# EAGLE design sd_adapter (EAGLE 7.6.0)
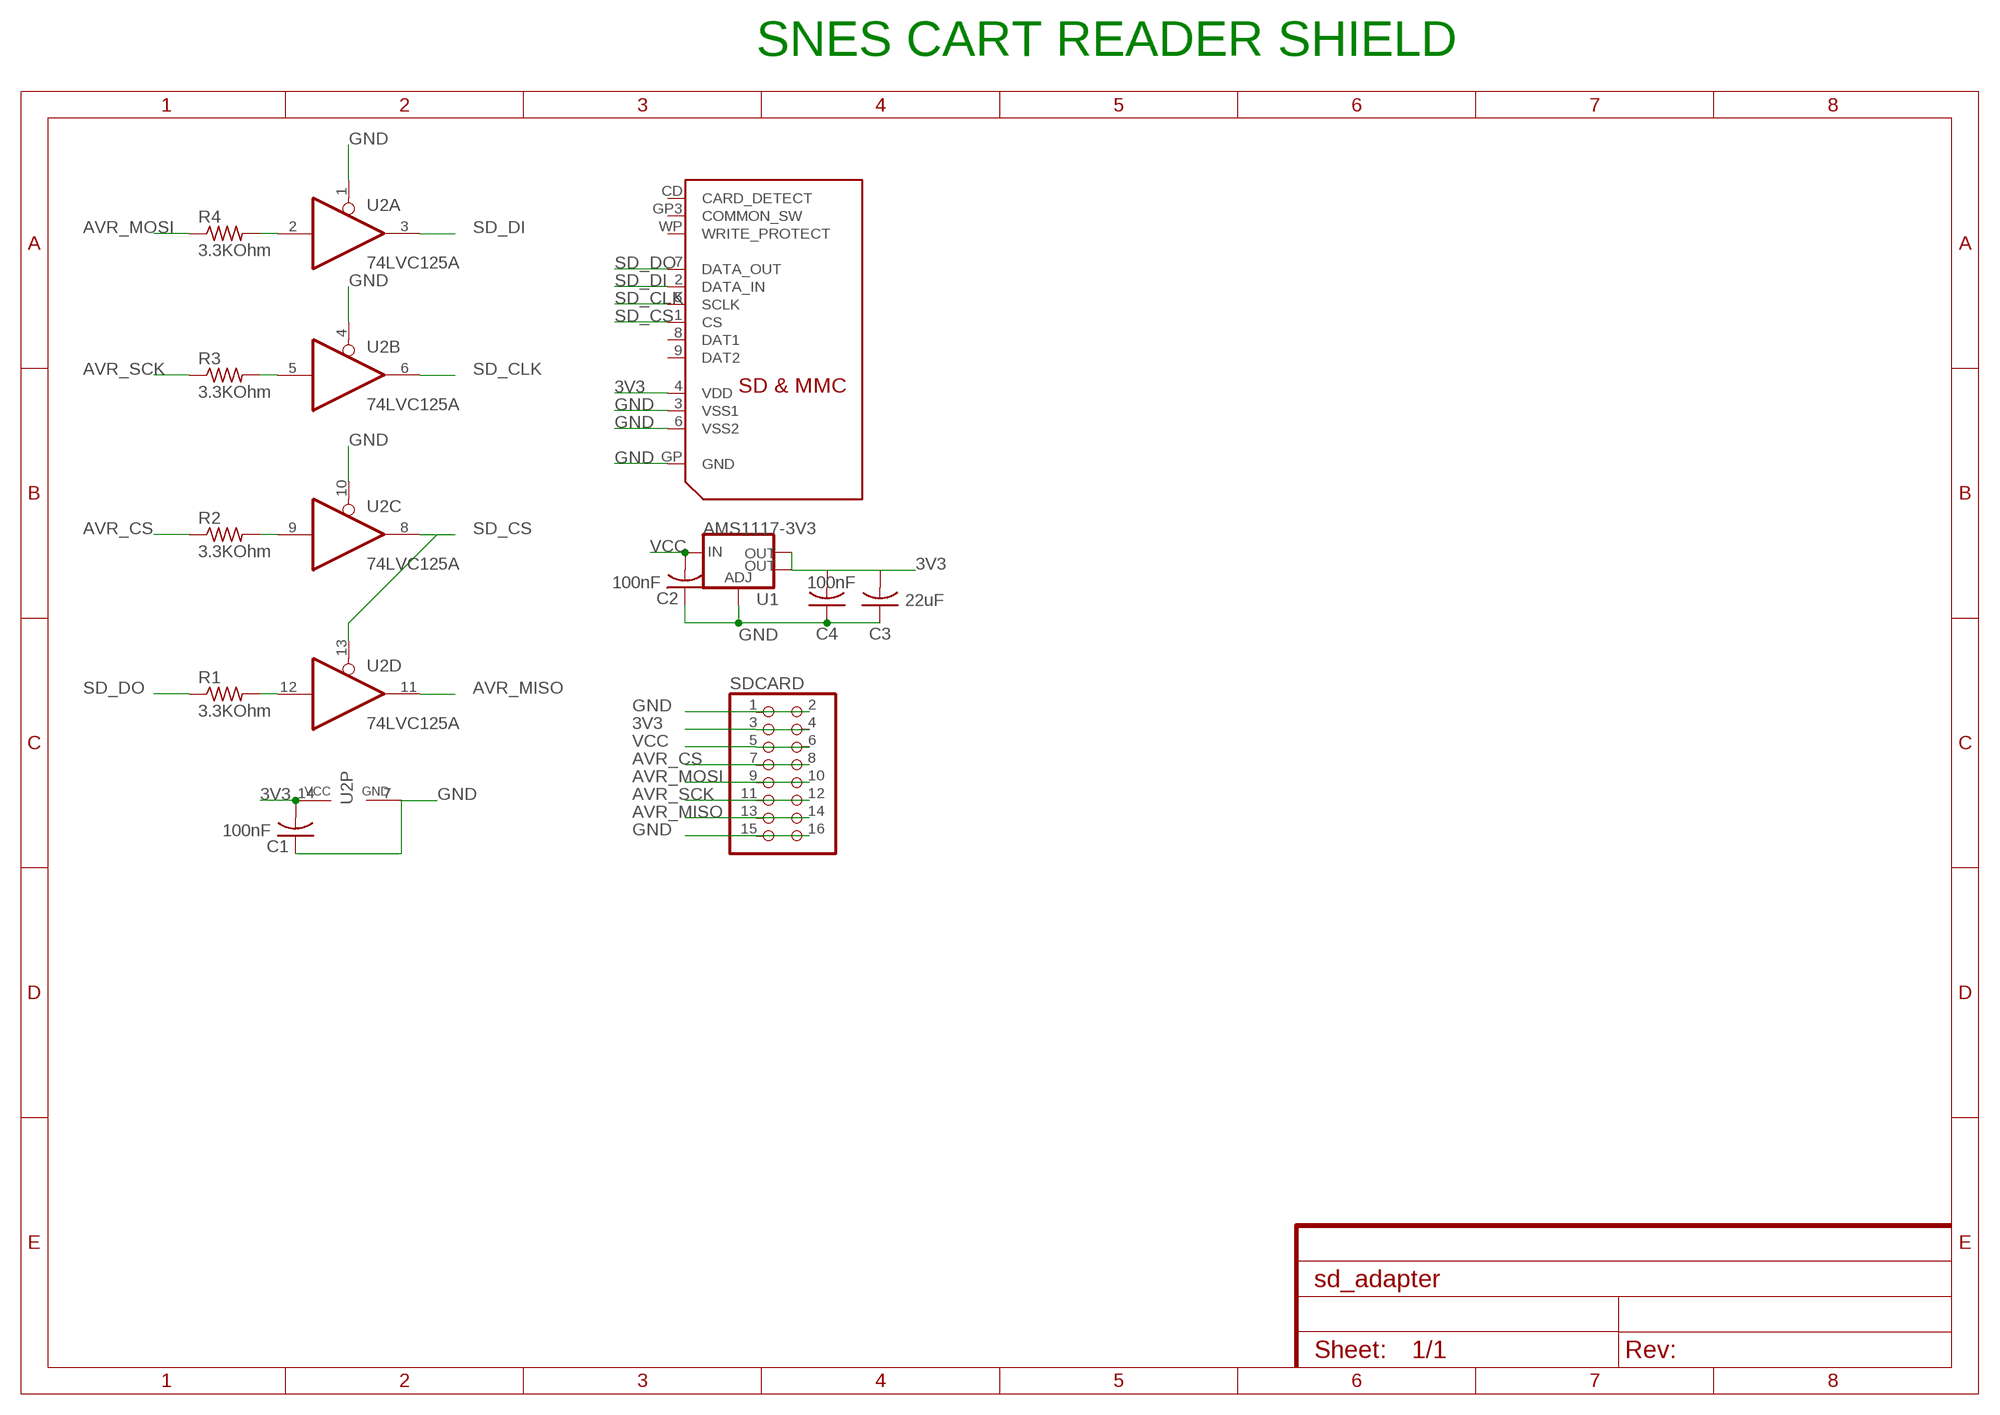
[diagram p0: schematic, sheet 1]

## Parts
C1  100nF  C-USC0805  [C0805]
C2  100nF  C-USC0805  [C0805]
C3  22uF  C-USC0805  [C0805]
C4  100nF  C-USC0805  [C0805]
R1  3.3KOhm  R-US_R0805  [R0805]
R2  3.3KOhm  R-US_R0805  [R0805]
R3  3.3KOhm  R-US_R0805  [R0805]
R4  3.3KOhm  R-US_R0805  [R0805]
SDCARD  PINHD-2X8_2.54  [2X08]
U1  AMS1117-3V3  SMD-AMS1117SOT223  [SOT223]
U2  74LVC125A  74ABT125PW  [TSSOP14]
U$1  SDMMC06132  [06132]

## Nets
3V3 [power usb]: C1.2 C3.2 C4.2 SDCARD.3 SDCARD.4 U1.2(OUT) U1.4(OUT) U2.14(P:VCC) U$1.4(VDD)
AVR_CS: R2.1 SDCARD.7 SDCARD.8
AVR_MISO: SDCARD.13 SDCARD.14 U2.11(D:O)
AVR_MOSI: R4.1 SDCARD.9 SDCARD.10
AVR_SCK: R3.1 SDCARD.11 SDCARD.12
GND [gnd]: C1.1 C2.1 C3.1 C4.1 SDCARD.1 SDCARD.2 SDCARD.15 SDCARD.16 U1.1(ADJ) U2.1(A:OE) U2.4(B:OE) U2.7(P:GND) U2.10(C:OE) U$1.3(VSS1) U$1.6(VSS2) U$1.GP(GND)
N$7: R1.2 U2.12(D:I)
N$10: R2.2 U2.9(C:I)
N$12: R3.2 U2.5(B:I)
N$14: R4.2 U2.2(A:I)
SD_CLK: U2.6(B:O) U$1.5(SCLK)
SD_CS: U2.8(C:O) U2.13(D:OE) U$1.1(CS)
SD_DI: U2.3(A:O) U$1.2(DATA_IN)
SD_DO: R1.1 U$1.7(DATA_OUT)
VCC: C2.2 SDCARD.5 SDCARD.6 U1.3(IN)
Unconnected: U$1.8(DAT1) U$1.9(DAT2) U$1.CD(CARD_DETECT) U$1.GP3(COMMON_SW) U$1.WP(WRITE_PROTECT)

## Notes on the sheet
- SNES CART READER SHIELD

## Library data of the parts
C1-C4 = adafruit:C-US: CAPACITOR, American symbol
R1-R4 = adafruit:R-US_: RESISTOR, American symbol
SDCARD = cartreadershield:PINHD-2X8: PIN HEADER
U1 = !sanni:SMD-AMS1117: Voltage Regulator LM1117 Standard adjustable voltage regulator but in SMD form. Spark Fun Electronics SKU : COM-00595; PROD_ID: VREG-08170
U2 = 74xx-eu:74*125: Quad bus BUFFER, 3-state
U$1 = adafruit:SDMMC: SD MMC Card holder 4UCON part #06132 - easy to solder

## Net classes
0 default: width 0.254 mm, drill 0.305 mm, clearance 0.203 mm
1 power: width 0.61 mm, drill 0.406 mm, clearance 0.203 mm
2 gnd: width 0.61 mm, drill 0.406 mm, clearance 0.203 mm
3 power usb: width 0.508 mm, drill 0.406 mm, clearance 0.203 mm

## Board
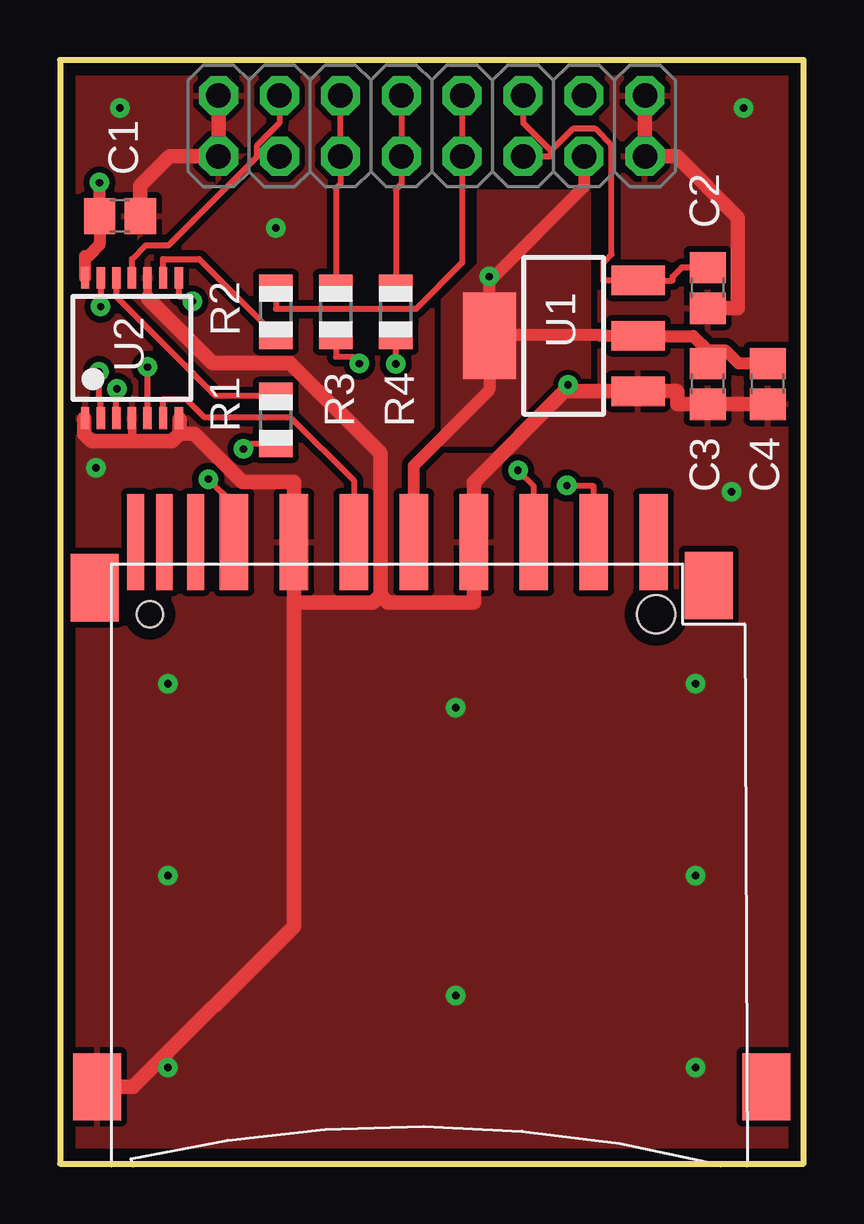
[diagram p1: board, top side]
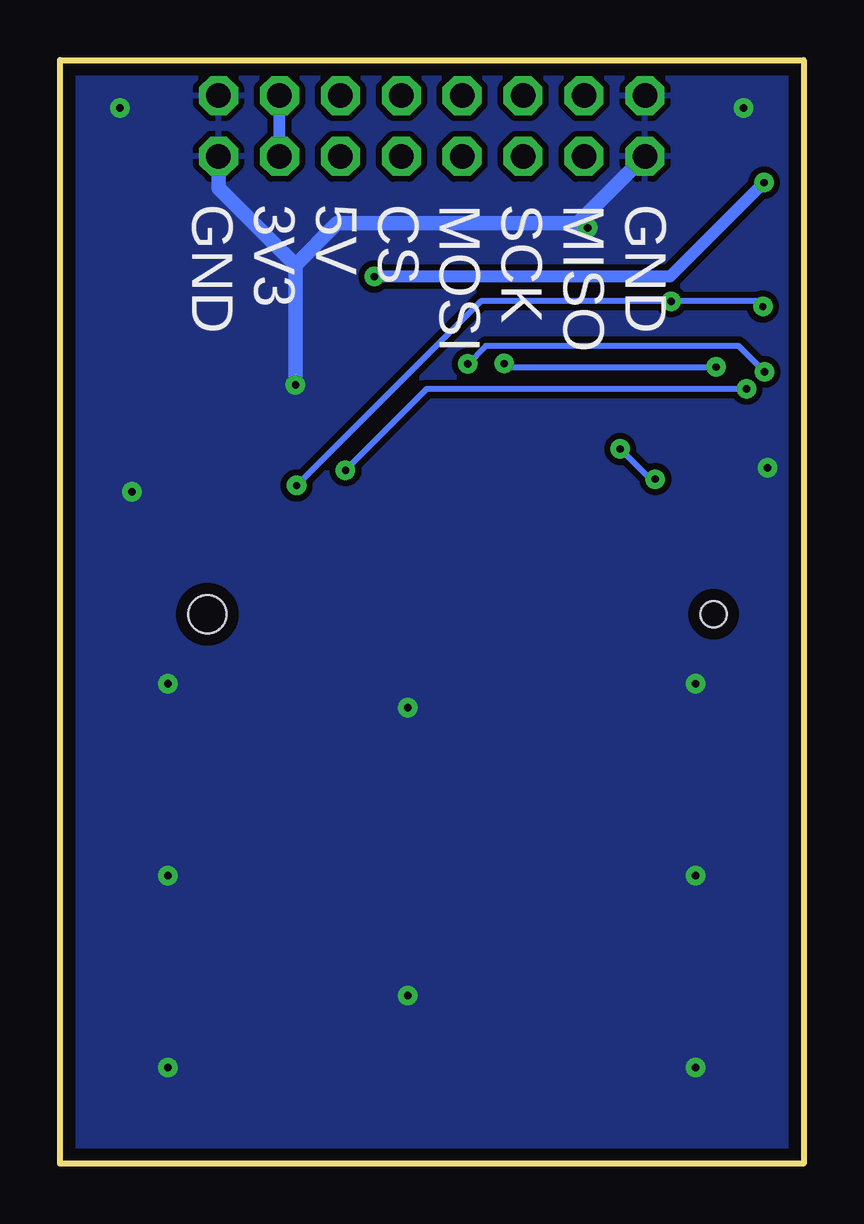
[diagram p2: board, bottom side, seen from below]

Size 31 x 46 mm. Coordinates in mm from the lower left corner, seen from the top.
Outline: 31,0 31,46 0,46 0,0 31,0
Copper layers (1*16): Top 0.035mm / dielectric 1.5mm / Bottom 0.035mm
Design rules "SparkFun_small": minimum track width 8mil, minimum drill 12mil, track to track 8mil, track to pad 8mil, pad to pad 8mil, via to via 8mil, smd to smd 8mil, copper to edge 20mil, drill to drill 12mil, minimum pad ring 12mil, minimum via ring 10mil, stop-mask expansion 4mil, vias tented up to drill 25mil, thermal gap 10mil

### Footprints (pad centres in the part's own frame; a part is rotated, then mirrored left to right if it is on the bottom)
C0805 = smd 1.3 x 1.5: 1 -0.85,0; 2 0.85,0
R0805 = smd 1.1 x 1.4: 1 -1,0; 2 1,0
2X08 = drill 1.016 octagon: 1 -8.89,-1.27; 2 -8.89,1.27; 3 -6.35,-1.27; 4 -6.35,1.27; 5 -3.81,-1.27; 6 -3.81,1.27; 7 -1.27,-1.27; 8 -1.27,1.27; 9 1.27,-1.27; 10 1.27,1.27; 11 3.81,-1.27; 12 3.81,1.27; 13 6.35,-1.27; 14 6.35,1.27; 15 8.89,-1.27; 16 8.89,1.27
SOT223 = smd 1.219 x 2.235: 1 -2.311,-3.099; 2 0,-3.099; 3 2.311,-3.099 | smd 3.6 x 2.2: 4 0,3.099
TSSOP14 = smd 0.35 x 0.9: 1 -1.95,-2.925; 2 -1.3,-2.925; 3 -0.65,-2.925; 4 0,-2.925; 5 0.65,-2.925; 6 1.3,-2.925; 7 1.95,-2.925; 8 1.95,2.925; 9 1.3,2.925; 10 0.65,2.925; 11 0,2.925; 12 -0.65,2.925; 13 -1.3,2.925; 14 -1.95,2.925
06132 = smd 1.2 x 4: 1 6.9,0.9; 2 4.4,0.9; 3 1.9,0.9; 4 -0.6,0.9; 5 -3.1,0.9; 6 -5.6,0.9; 7 -8.1,0.9; 9 9.4,0.9 | smd 0.7 x 4: 8 -9.7,0.9; CD -11,0.9; WP -12.2,0.9 | smd 2 x 2.8: GP -13.8,-21.8; GP2 14.1,-21.8; GP3 11.7,-0.9; GP4 -13.9,-1 | hole 1.1: -11.6,-2.1 | hole 1.6: 9.5,-2.1

### Placement (x,y rotation side)
C1  2.5,39.5 180 top
C2  27,36.5 90 top
C3  27,32.5 90 top
C4  29.5,32.5 90 top
R1  9,31 90 top
R2  9,35.5 270 top
R3  11.5,35.5 270 top
R4  14,35.5 270 top
SDCARD  15.5,43.25 180 top
U1  21,34.5 90 top
U2  3,34 0 top
U$1  15.35,25 0 top

### Tracks (layer width: path | path; a pad name or v marks a point on that pad's centre or on a via)
3V3  (via drill 0.3 pad 0.81)
  Top 0.508: SDCARD.4 21.85,40.71 18.11,36.97 v17.9,36.97 17.9,36.76 17.9,34.7 17.9,34.54 | 17.9,34.54 22.48,34.54 22.52,34.5 U1.2 26.4,34.5 27,33.9 | 17.9,34.54 U1.4 17.9,32.24 14.75,29.09 U$1.4 | U2.14 1.05,37.83 1.19,37.83 1.65,38.29 C1.2 v1.65,40.89 | C4.2 28.29,33.35 27.74,33.9 27,33.9 | C3.2 27,33.9
  Bottom 0.508: v1.65,40.89 5.57,36.97 v17.9,36.97 | SDCARD.4 SDCARD.3
  pour Top (no thermals): 17.5,40.5 22,40.5 22,30 16,30 16,35.5 16,36 17.5,37.5
AVR_CS
  Top 0.254: SDCARD.7 SDCARD.8 16.77,40.84 16.77,37.55 14.84,35.62 9,35.62 R2.1
AVR_MISO
  Top 0.254: U2.11 3,37.7 3.57,38.28 4.53,38.28 8.22,41.97 8.22,41.98 | SDCARD.13 9.15,43.38 8.22,42.45 8.22,41.98 | SDCARD.14 8.22,41.98
AVR_MOSI
  Top 0.254: R4.1 14,40.61 14.23,40.84 SDCARD.10 SDCARD.9
AVR_SCK
  Top 0.254: R3.1 11.5,40.65 11.69,40.84 SDCARD.12 SDCARD.11
GND  (via drill 0.3 pad 0.81)
  Top 0.35: 4.99,31.03 U2.7 | 3.65,36.08 U2.10 | 1.02,31.04 U2.1 | 3,30.12 U2.4
  Top 0.61: 13.36,23.7 13.67,23.39 17.25,23.39 U$1.3 17.25,28.41 21.03,32.19 21.18,32.19 | 3.65,36.08 6.36,33.37 9.6,33.37 13.36,29.61 13.36,23.7 | 9.75,23.39 13.06,23.39 13.36,23.7 | 21.18,32.19 v21.18,32.46 | 21.18,32.19 23.29,32.19 U1.1 25.72,32.19 25.74,32.17 25.74,31.65 C3.1 C4.1 | 4.99,30.42 5.6,30.42 7.62,28.41 9.75,28.41 U$1.6 9.75,23.39 | 4.99,30.42 4.69,30.12 3,30.12 1.31,30.12 1.02,30.41 1.02,31.04 | 4.99,30.42 4.99,31.03 | SDCARD.1 SDCARD.2 25.71,41.98 28.26,39.43 28.26,35.65 C2.1 | 9.75,23.39 9.75,9.89 3.06,3.2 U$1.GP | SDCARD.15 SDCARD.16 4.57,41.98 3.35,40.76 C1.1
  Bottom 0.61: 21.18,37.45 24.39,40.66 SDCARD.2 | v21.18,32.46 21.18,37.45 | SDCARD.16 9.4,39.19 19.44,39.19 21.18,37.45
  other vias: 2.5,44 28.5,44 4.5,20 26.5,20 26.5,12 4.5,12 4.5,4 26.5,4 9,39 1.5,29 28,28 16.5,7 16.5,19
  pour Bottom (isolate 0.254, rank 2): 0,46 0,0 31,0 31,46
  pour Top (isolate 0.254, rank 2): 0,46 0,0 31,0 31,46
N$7
  Top 0.254: R1.2 6.5,32 2.35,36.15 U2.12
N$10
  Top 0.254: U2.9 4.3,37.7 5.79,37.7 R2.2
N$12  (via drill 0.3 pad 0.81)
  Top 0.254: U2.5 v3.65,33.2 | v12.48,33.35 12.21,33.62 11.5,33.62 R3.2
  Bottom 0.254: v12.48,33.35 12.33,33.2 v3.65,33.2
N$14  (via drill 0.3 pad 0.81)
  Top 0.254: U2.2 1.7,31.86 1.63,31.93 v1.63,33.01 | v14,33.33 R4.2
  Bottom 0.254: v14,33.33 13.24,34.09 2.71,34.09 v1.63,33.01
SD_CLK
  Top 0.254: U2.6 4.3,31.86 5.27,31.86 6,31.12 9.6,31.12 12.25,28.47 U$1.5
SD_CS  (via drill 0.3 pad 0.81)
  Top 0.254: v21.14,28.26 21.17,28.23 22.25,28.23 U$1.1 | U2.13 1.7,36.15 1.7,36.14 v1.7,35.72 | v5.53,35.94 5.32,36.15 4.95,36.15 U2.8
  Bottom 0.254: v21.14,28.26 13.46,35.94 v5.53,35.94 1.92,35.94 v1.7,35.72
SD_DI  (via drill 0.3 pad 0.81)
  Top 0.254: U2.3 2.35,31.86 2.37,31.88 v2.37,32.29 | v19.09,28.9 19.09,28.89 19.75,28.23 U$1.2
  Bottom 0.254: v2.37,32.29 15.71,32.29 v19.09,28.9
SD_DO  (via drill 0.3 pad 0.81)
  Top 0.254: U$1.7 7.25,27.46 v6.18,28.53 | v7.64,29.78 7.75,29.78 7.97,30 R1.1
  Bottom 0.254: v7.64,29.78 6.39,28.53 v6.18,28.53
VCC
  Top 0.254: 20.47,42.22 21.38,43.13 22.32,43.13 23,42.45 23,37.9 22.65,37.56 22.65,36.81 U1.3 25.55,36.81 25.55,36.98 25.92,37.35 C2.2 | 20.47,42.22 20.45,42.2 20.45,41.98 SDCARD.6 | 20.47,42.22 19.31,43.38 SDCARD.5

### Text on the board
bNames: GND / MISO / SCK / MOSI / CS / 5V / 3V3 / GND